# EAGLE schematic schematic (EAGLE 6.2)
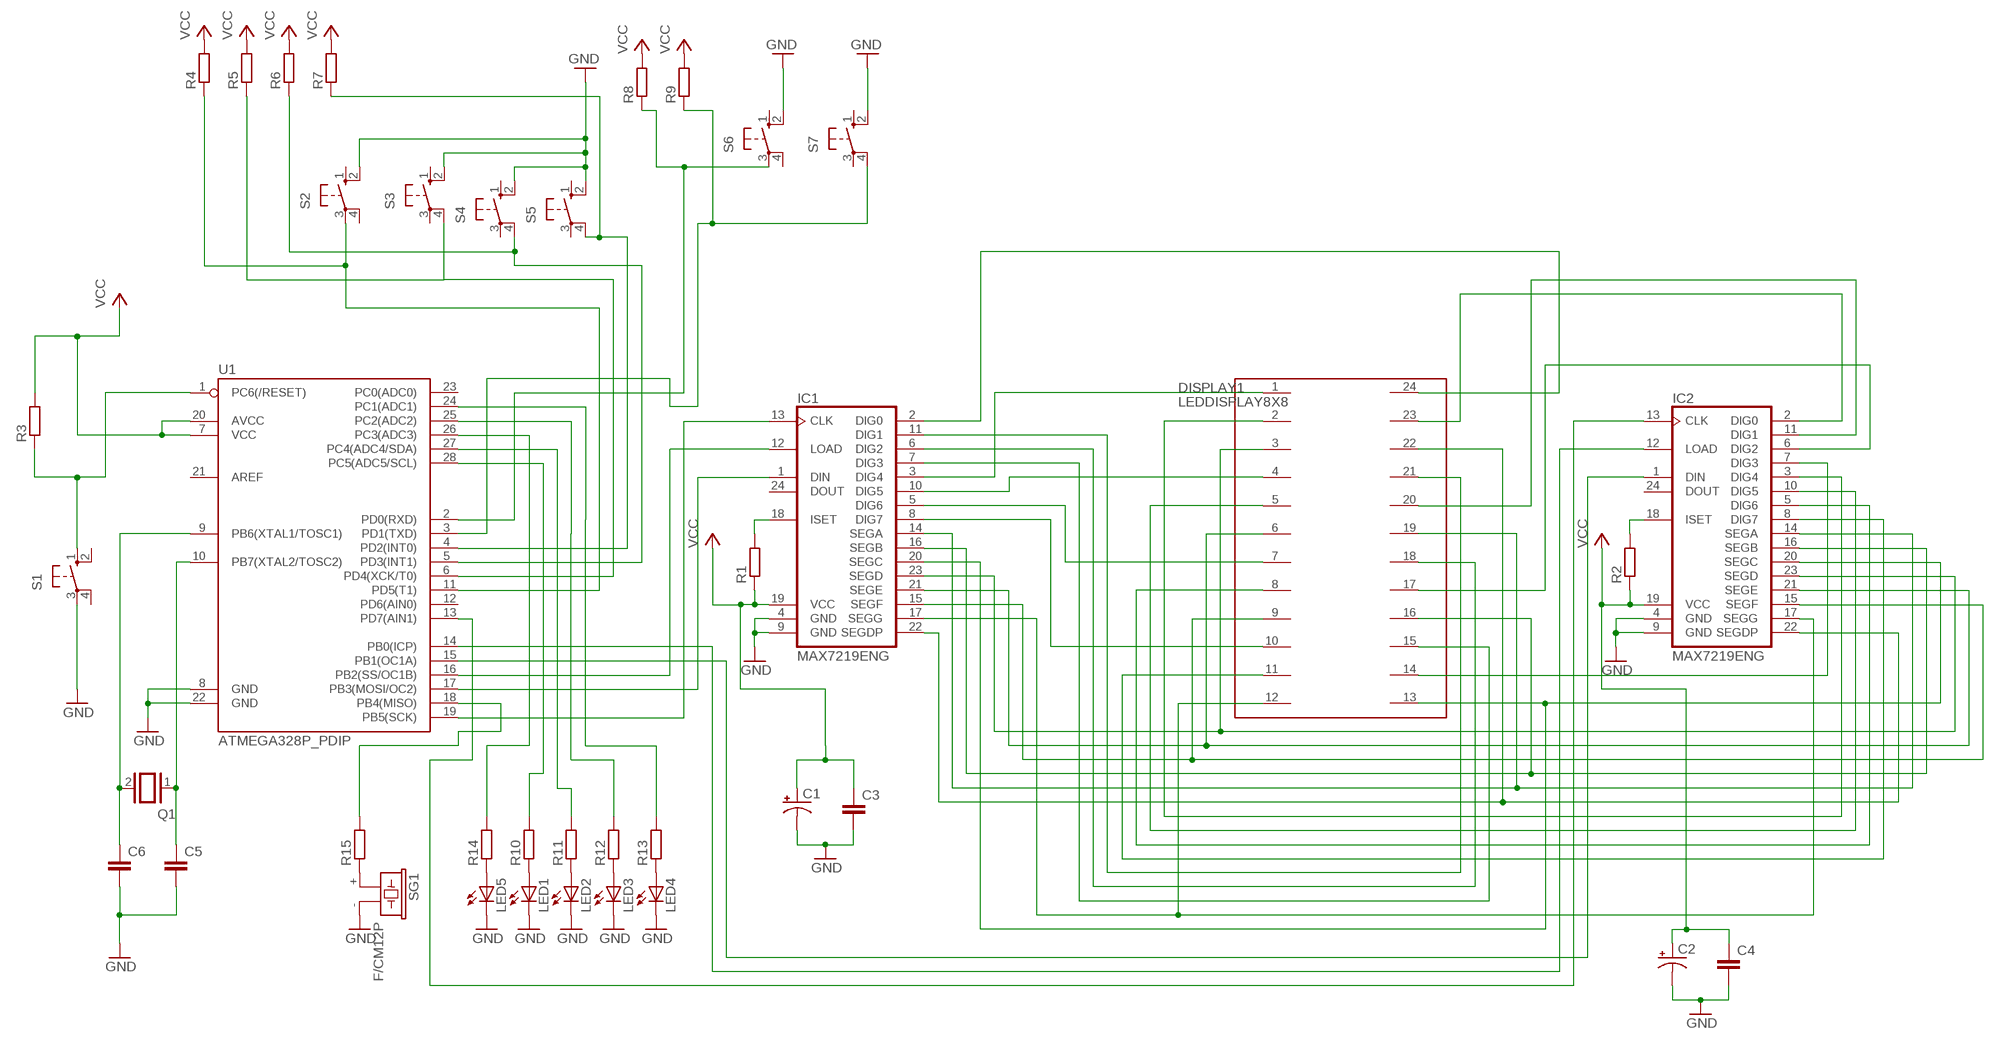
[diagram p0: schematic, sheet 1]

## Parts
C1  CPOL-USE2.5-6  [E2,5-6]
C2  CPOL-USE2.5-6  [E2,5-6]
C3  C-EU025-024X044  [C025-024X044]
C4  C-EU025-024X044  [C025-024X044]
C5  C-EU025-024X044  [C025-024X044]
C6  C-EU025-024X044  [C025-024X044]
DISPLAY1  LEDDISPLAY8X8  [LEDDISPLAY8X8]
IC1  MAX7219ENG  [DIL24-3]
IC2  MAX7219ENG  [DIL24-3]
LED1  LED5MM  [LED5MM]
LED2  LED5MM  [LED5MM]
LED3  LED5MM  [LED5MM]
LED4  LED5MM  [LED5MM]
LED5  LED5MM  [LED5MM]
Q1  XTAL  [Q]
R1  R-EU_0204/7  [0204/7]
R2  R-EU_0204/7  [0204/7]
R3  R-EU_0204/7  [0204/7]
R4  R-EU_0204/7  [0204/7]
R5  R-EU_0204/7  [0204/7]
R6  R-EU_0204/7  [0204/7]
R7  R-EU_0204/7  [0204/7]
R8  R-EU_0204/7  [0204/7]
R9  R-EU_0204/7  [0204/7]
R10  R-EU_0204/7  [0204/7]
R11  R-EU_0204/7  [0204/7]
R12  R-EU_0204/7  [0204/7]
R13  R-EU_0204/7  [0204/7]
R14  R-EU_0204/7  [0204/7]
R15  R-EU_0204/7  [0204/7]
S1  10-XX  [B3F-10XX]
S2  40-XX  [B3F-40XX]
S3  40-XX  [B3F-40XX]
S4  40-XX  [B3F-40XX]
S5  40-XX  [B3F-40XX]
S6  40-XX  [B3F-40XX]
S7  40-XX  [B3F-40XX]
SG1  F/CM12P  [F/CM12P]
U1  ATMEGA328P_PDIP  [DIL28-3]

## Nets
GND: C1.- C2.- C3.2 C4.2 C5.2 C6.2 IC1.4(GND) IC1.9(GND) IC2.4(GND) IC2.9(GND) LED1.K(C) LED2.K(C) LED3.K(C) LED4.K(C) LED5.K(C) S1.3(P) S2.2(S1) S3.2(S1) S4.2(S1) S5.2(S1) S6.2(S1) S7.2(S1) SG1.- U1.8(GND) U1.22(GND)
N$1: R15.2 U1.18(PB4(MISO))
N$2: DISPLAY1.19 IC1.14(SEGA) IC2.14(SEGA)
N$3: DISPLAY1.16 IC1.16(SEGB) IC2.16(SEGB)
N$4: DISPLAY1.13 IC1.20(SEGC) IC2.20(SEGC)
N$5: DISPLAY1.3 IC1.23(SEGD) IC2.23(SEGD)
N$6: DISPLAY1.6 IC1.21(SEGE) IC2.21(SEGE)
N$7: DISPLAY1.9 IC1.15(SEGF) IC2.15(SEGF)
N$8: DISPLAY1.12 IC1.17(SEGG) IC2.17(SEGG)
N$9: DISPLAY1.23 IC2.2(DIG0)
N$10: DISPLAY1.20 IC2.11(DIG1)
N$11: DISPLAY1.17 IC2.6(DIG2)
N$12: DISPLAY1.14 IC2.7(DIG3)
N$13: DISPLAY1.2 IC2.3(DIG4)
N$14: DISPLAY1.5 IC2.10(DIG5)
N$15: DISPLAY1.8 IC2.5(DIG6)
N$16: DISPLAY1.11 IC2.8(DIG7)
N$17: DISPLAY1.24 IC1.2(DIG0)
N$18: DISPLAY1.21 IC1.11(DIG1)
N$19: DISPLAY1.18 IC1.6(DIG2)
N$20: DISPLAY1.15 IC1.7(DIG3)
N$21: DISPLAY1.1 IC1.3(DIG4)
N$22: DISPLAY1.4 IC1.10(DIG5)
N$23: DISPLAY1.7 IC1.5(DIG6)
N$24: DISPLAY1.10 IC1.8(DIG7)
N$25: IC1.1(DIN) U1.17(PB3(MOSI/OC2))
N$26: IC2.13(CLK) U1.13(PD7(AIN1))
N$27: IC2.12(LOAD) U1.14(PB0(ICP))
N$28: IC1.18(ISET) R1.2
N$29: IC2.18(ISET) R2.2
N$30: IC1.13(CLK) U1.19(PB5(SCK))
N$31: IC2.1(DIN) U1.15(PB1(OC1A))
N$32: IC1.12(LOAD) U1.16(PB2(SS/OC1B))
N$33: R7.1 S5.4(P1) U1.4(PD2(INT0))
N$34: R6.1 S4.4(P1) U1.5(PD3(INT1))
N$35: R3.1 S1.1(S) U1.1(PC6(/RESET))
N$36: R5.1 S3.4(P1) U1.6(PD4(XCK/T0))
N$37: LED1.A R10.1
N$38: LED5.A R14.1
N$39: R14.2 U1.26(PC3(ADC3))
N$40: R8.1 S6.3(P) U1.2(PD0(RXD))
N$41: DISPLAY1.22 IC1.22(SEGDP) IC2.22(SEGDP)
N$42: R9.1 S7.4(P1) U1.3(PD1(TXD))
N$43: LED2.A R11.1
N$44: LED3.A R12.1
N$45: LED4.A R13.1
N$46: R13.2 U1.24(PC1(ADC1))
N$47: R12.2 U1.25(PC2(ADC2))
N$48: R11.2 U1.27(PC4(ADC4/SDA))
N$49: R10.2 U1.28(PC5(ADC5/SCL))
N$50: R15.1 SG1.+
N$53: C5.1 Q1.1 U1.10(PB7(XTAL2/TOSC2))
N$54: C6.1 Q1.2 U1.9(PB6(XTAL1/TOSC1))
N$55: R4.1 S2.3(P) U1.11(PD5(T1))
VCC: C1.+ C2.+ C3.1 C4.1 IC1.19(VCC) IC2.19(VCC) R1.1 R2.1 R3.2 R4.2 R5.2 R6.2 R7.2 R8.2 R9.2 U1.7(VCC) U1.20(AVCC)
Unconnected: IC1.24(DOUT) IC2.24(DOUT) S1.2(S1) S1.4(P1) S2.1(S) S2.4(P1) S3.1(S) S3.3(P) S4.1(S) S4.3(P) S5.1(S) S5.3(P) S6.1(S) S6.4(P1) S7.1(S) S7.3(P) U1.12(PD6(AIN0)) U1.21(AREF) U1.23(PC0(ADC0))

## Library data of the parts
C1 C2 = rcl:CPOL-US: POLARIZED CAPACITOR, American symbol
C3-C6 = rcl:C-EU: CAPACITOR, European symbol
DISPLAY1 = displayled8x8:LEDDISPLAY8X8
IC1 IC2 = maxim-5:MAX7219*: Serially Interfaced, 8-Digit LED Display Drivers
LED1-LED5 = led:LED: LED OSRAM: - CHIPLED LG R971, LG N971, LY N971, LG Q971, LY Q971, LO R971, LY R971 LH N974, LH R974 LS Q976, LO Q976, LY Q976 LO Q996 - Hyper CHIPLED LW Q18S LB Q993, LB Q99A, LB R99A - SideLED LS A670, LO A670, LY A670, LG A670, LP A670 LB A673, LV A673, LT A673, LW A673 LH A674 LY A675 LS A676, LA A676, LO A676, LY A676, LW A676 LS A679, LY A679, LG A679 - Hyper Micro SIDELED® LS Y876, LA Y876, LO Y876, LY Y876 LT Y87S - SmartLED LW L88C, LW L88S LB L89C, LB L89S, LG L890 LS L89K, LO L89K, LY L89K LS L896, LA L896, LO L896, LY L896 - TOPLED LS T670, LO T670, LY T670, LG T670, LP T670 LSG T670, LSP T670, LSY T670, LOP T670, LYG T670 LG T671, LOG T671, LSG T671 LB T673, LV T673, LT T673, LW T673 LH T674 LS T676, LA T676, LO T676, LY T676, LB T676, LH T676, LSB T676, LW T676 LB T67C, LV T67C, LT T67C, LS T67K, LO T67K, LY T67K, LW E67C LS E67B, LA E67B, LO E67B, LY E67B, LB E67C, LV E67C, LT E67C LW T67C LS T679, LY T679, LG T679 LS T770, LO T770, LY T770, LG T770, LP T770 LB T773, LV T773, LT T773, LW T773 LH T774 LS E675, LA E675, LY E675, LS T675 LS T776, LA T776, LO T776, LY T776, LB T776 LHGB T686 LT T68C, LB T68C - Hyper Mini TOPLED® LB M676 - Mini TOPLED Santana® LG M470 LS M47K, LO M47K, LY M47K Source: http://www.osram.convergy.de LUXEON: - LUMILED® LXK2-PW12-R00, LXK2-PW12-S00, LXK2-PW14-U00, LXK2-PW14-V00 LXK2-PM12-R00, LXK2-PM12-S00, LXK2-PM14-U00 LXK2-PE12-Q00, LXK2-PE12-R00, LXK2-PE12-S00, LXK2-PE14-T00, LXK2-PE14-U00 LXK2-PB12-K00, LXK2-PB12-L00, LXK2-PB12-M00, LXK2-PB14-N00, LXK2-PB14-P00, LXK2-PB14-Q00 LXK2-PR12-L00, LXK2-PR12-M00, LXK2-PR14-Q00, LXK2-PR14-R00 LXK2-PD12-Q00, LXK2-PD12-R00, LXK2-PD12-S00 LXK2-PH12-R00, LXK2-PH12-S00 LXK2-PL12-P00, LXK2-PL12-Q00, LXK2-PL12-R00 Source: www.luxeon.com KINGBRIGHT: KA-3528ASYC Source: www.kingbright.com
Q1 = special:XTAL: CRYSTAL
R1-R15 = resistor:R-EU_: RESISTOR, European symbol
S1 = switch-omron:10-XX: OMRON SWITCH; MPN: B3F-1000; OC_FARNELL: 176432; OC_NEWARK: 36M3542
S2-S7 = switch-omron:40-XX: OMRON SWITCH; MF: OMRON COMPONENTS USA; MPN: B3F-4000; OC_FARNELL: 176434; OC_NEWARK: 36K3105
SG1 = buzzer:F/CM12P: BUZZER Source: Buerklin; OC_FARNELL: unknown; OC_NEWARK: unknown
U1 = SparkFun-DigitalIC:ATMEGA328P_PDIP: uC used in the Arduino 32kb flash, 1k EEPROM, 2k SRAM This is the through-hole version of this chip.